# Altium schematic sheet Expansion _&_mikroBUS_Connectors.SchDoc: EXPANSION_&_mikroBUS_ Connectors
size A3; CompanyName: STMicroelectronics; Organization: Microcontrollers Division; Address1: 12, Rue Jules HOROWITZ; Address2: 38019 Grenoble; Address3: FRANCE; Revision: A-01; SheetNumber: 16; SheetTotal: 18; DocumentName: ARDUINO_ Connectors.SchDoc
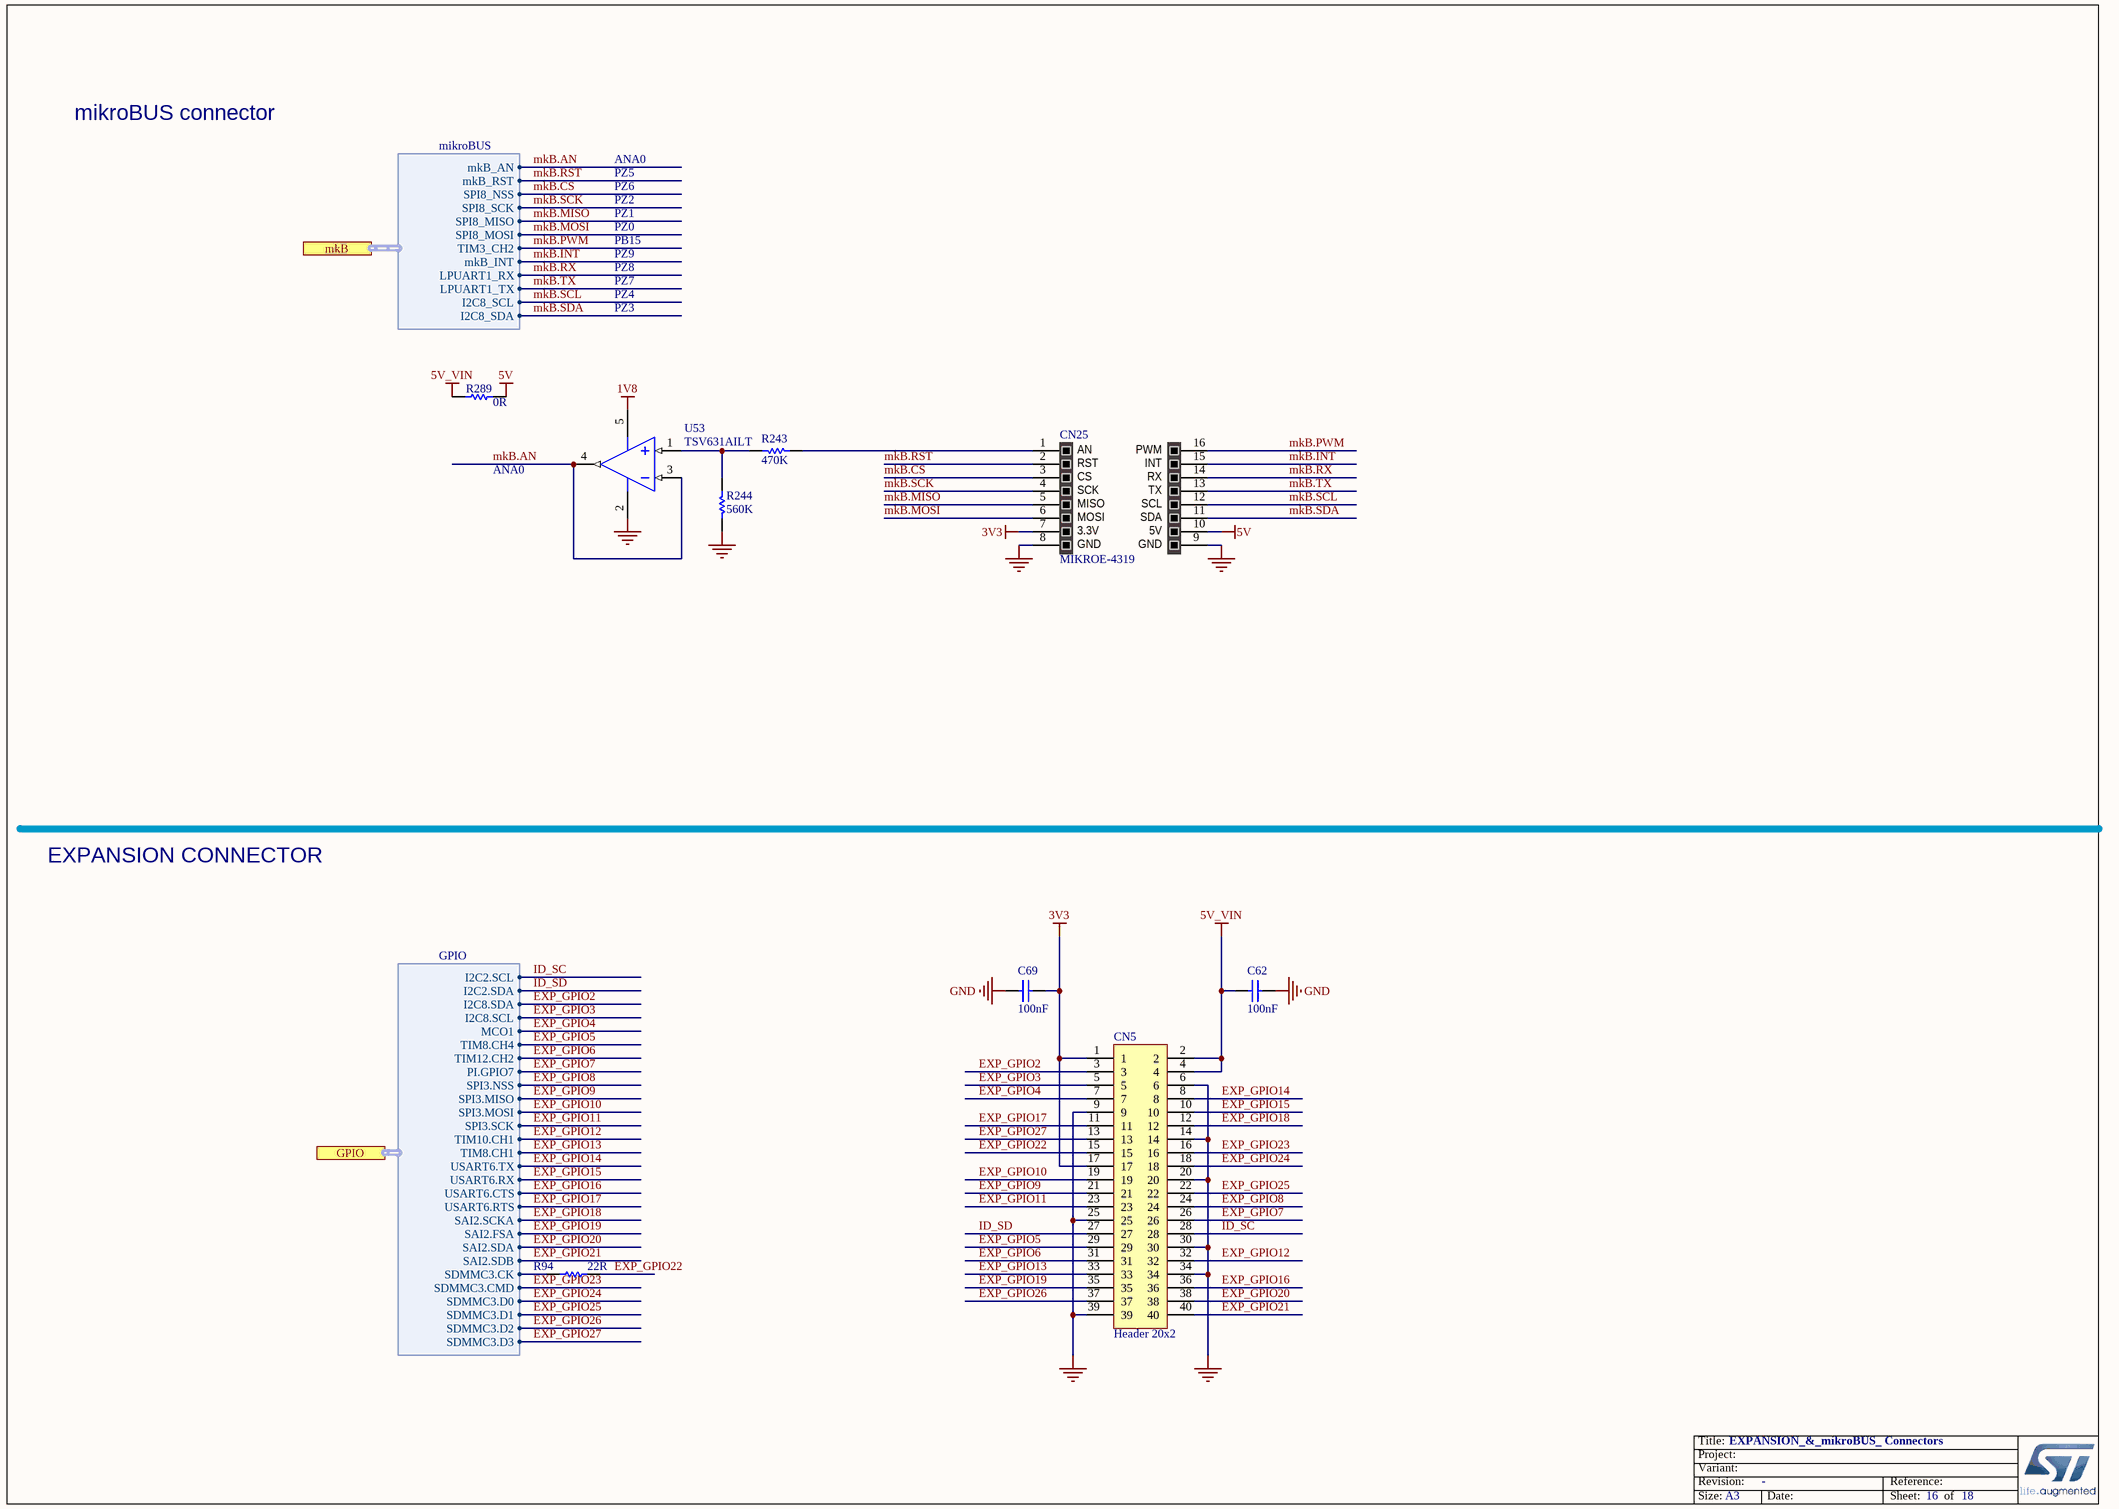
[diagram p0: Expansion _&_mikroBUS_Connectors.SchDoc]

## Parts
C62  value 100nF  [C0402]  (hidden comment: Capacitor)
C69  value 100nF  [C0402]  (hidden comment: Capacitor)
CN5  Header 20x2  [CON_SAMTEC_TSW-120-07-G-D]
CN25  MIKROE-4319  [SOCKET_MIKROBUS_MIKROE-4319_SMD_P254]
R94  value 22R  [R0201_H0P23]  (hidden comment: Resistor)
R243  value 470K  [R0402]  (hidden comment: Resistor)
R244  value 560K  [R0402]  (hidden comment: Resistor)
R289  value 0R  [R0402]
U53  TSV631AILT  [AOP_SOT23-5L_H1P45]

## Ports
GPIO (harness GPIO), mkB (harness mikroBUS)

## Harnesses
GPIO: I2C2.SCL, I2C2.SDA, I2C8.SDA, MCO1, TIM8.CH4, TIM12.CH2, PI.GPIO7, SPI3.NSS, SPI3.MISO, SPI3.MOSI, SPI3.SCK, TIM10.CH1, TIM8.CH1, USART6.TX, USART6.RX, USART6.CTS, USART6.RTS, SDMMC3.CK, SDMMC3.CMD, SDMMC3.D0, SDMMC3.D1, SDMMC3.D2, SDMMC3.D3, I2C8.SCL, SAI2.SCKA, SAI2.FSA, SAI2.SDA, SAI2.SDB
mikroBUS: I2C8_SDA, SPI8_NSS, SPI8_MISO, SPI8_MOSI, SPI8_SCK, TIM3_CH2, LPUART1_RX, I2C8_SCL, LPUART1_TX, mkB_INT, mkB_RST, mkB_AN

## Nets
1V8: U53.5(VCC)
3V3: C69.1 CN5.1 CN5.17 CN25.7
5V: CN25.10 R289.2
5V_VIN: C62.2 CN5.2 CN5.4 R289.1
GND: C62.1 C69.2 CN5.6 CN5.9 CN5.14 CN5.20 CN5.25 CN5.30 CN5.34 CN5.39 CN25.8 CN25.9 R244.1 U53.2(VDD)
EXP_GPIO2: CN5.3 ; port GPIO.I2C8.SDA
EXP_GPIO3: CN5.5 ; port GPIO.I2C8.SCL
EXP_GPIO4: CN5.7 ; port GPIO.MCO1
EXP_GPIO5: CN5.29 ; port GPIO.TIM8.CH4
EXP_GPIO6: CN5.31 ; port GPIO.TIM12.CH2
EXP_GPIO7: CN5.26 ; port GPIO.PI.GPIO7
EXP_GPIO8: CN5.24 ; port GPIO.SPI3.NSS
EXP_GPIO9: CN5.21 ; port GPIO.SPI3.MISO
EXP_GPIO10: CN5.19 ; port GPIO.SPI3.MOSI
EXP_GPIO11: CN5.23 ; port GPIO.SPI3.SCK
EXP_GPIO12: CN5.32 ; port GPIO.TIM10.CH1
EXP_GPIO13: CN5.33 ; port GPIO.TIM8.CH1
EXP_GPIO14: CN5.8 ; port GPIO.USART6.TX
EXP_GPIO15: CN5.10 ; port GPIO.USART6.RX
EXP_GPIO16: CN5.36 ; port GPIO.USART6.CTS
EXP_GPIO17: CN5.11 ; port GPIO.USART6.RTS
EXP_GPIO18: CN5.12 ; port GPIO.SAI2.SCKA
EXP_GPIO19: CN5.35 ; port GPIO.SAI2.FSA
EXP_GPIO20: CN5.38 ; port GPIO.SAI2.SDA
EXP_GPIO21: CN5.40 ; port GPIO.SAI2.SDB
EXP_GPIO22: CN5.15 R94.2
EXP_GPIO23: CN5.16 ; port GPIO.SDMMC3.CMD
EXP_GPIO24: CN5.18 ; port GPIO.SDMMC3.D0
EXP_GPIO25: CN5.22 ; port GPIO.SDMMC3.D1
EXP_GPIO26: CN5.37 ; port GPIO.SDMMC3.D2
EXP_GPIO27: CN5.13 ; port GPIO.SDMMC3.D3
ID_SC: CN5.28 ; port GPIO.I2C2.SCL
ID_SD: CN5.27 ; port GPIO.I2C2.SDA
mkB.AN: U53.3(IN-) U53.4(OUT) ; port mkB.mkB_AN
mkB.CS: CN25.3 ; port mkB.SPI8_NSS
mkB.INT: CN25.15 ; port mkB.mkB_INT
mkB.MISO: CN25.5 ; port mkB.SPI8_MISO
mkB.MOSI: CN25.6 ; port mkB.SPI8_MOSI
mkB.PWM: CN25.16 ; port mkB.TIM3_CH2
mkB.RST: CN25.2 ; port mkB.mkB_RST
mkB.RX: CN25.14 ; port mkB.LPUART1_RX
mkB.SCK: CN25.4 ; port mkB.SPI8_SCK
mkB.SCL: CN25.12 ; port mkB.I2C8_SCL
mkB.SDA: CN25.11 ; port mkB.I2C8_SDA
mkB.TX: CN25.13 ; port mkB.LPUART1_TX
NetCN25_1: CN25.1 R243.1
NetR94_1: R94.1 ; port GPIO.SDMMC3.CK
NetR243_2: R243.2 R244.2 U53.1(IN+)

## Notes on the sheet
- mikroBUS connector
- ANA0
- PZ5
- PZ6
- PZ2
- PZ1
- PZ0
- PB15
- PZ9
- PZ8
- PZ7
- PZ4
- PZ3
- EXPANSION CONNECTOR
- Title:
- Project:
- Size:
- Revision:
- Variant:
- A3
- -
- Date:
- Reference:
- Sheet:
- of
- (in symbol MCD-03517) AN; PWM; RST; INT; CS; RX; SCK; TX; MISO; SCL; MOSI; SDA; 3.3V; 5V; GND

## Library data of the parts
C62 C69 = MCD-00006: Capacitor, MLCC, 100nF, 16V, X7R, +/-10%, 0402, T=0.5mm; Part_Preference: Recommended; Manufacturer: YAGEO; Manufacturer_Part_Number: CC0402KRX7R7BB104; Order_Code_RS: 616-9701; Component_Country_Of_Origin: China; ShowFields: YES; ID: 2474; Internal_Part_Number: MCD-00006; Status: Released; Part_Type: Capacitor; Package: 0402; ComponentLink1URL: http://tunmcdsvn.tun.st.com/Component_Documentation_Library/Trunk/Capacitor/YAGEO_X7R_Series; Order_Code_Digikey: 311-1338-1-ND; Order_Code_Farnell: 9402047
CN5 = MCD-00302: Header, 20x2, 2.54mm, VR, TH, T=5.84mm/2.54mm; Manufacturer_Part_Number: TSW-120-07-G-D; Manufacturer: SAMTEC; Part_Type: Connector; Part_Preference: Recommended; Order_Code_RS: 180-2456; Component_Country_Of_Origin: China, Costa Rica, Malaysia, United States, Vietnam; ShowFields: YES; ID: 2567; Internal_Part_Number: MCD-00302; Value: Header 20x2; ComponentLink1URL: http://tunmcdsvn.tun.st.com/Component_Documentation_Library/Trunk/Connector/SAMTEC_TSW_Series/; Status: Released; Order_Code_Digikey: SAM1028-20-ND; Order_Code_Farnell: 2779689
CN25 = MCD-03517: Socket , mikroBUS , 16 , SMD , Gray; Part_Type: Connector; Part_Preference: Recommended; Manufacturer: MIKROE; Component_Country_Of_Origin: Serbia; ShowFields: YES; ID: 5633; Internal_Part_Number: MCD-03517; Value: MIKROE-4319; Status: Checked; Manufacturer_Part_Number: MIKROE-4319; ComponentLink1URL: http://tunmcdsvn.tun.st.com/Component_Documentation_Library/Trunk/Connector/MIKROE_4319; Order_Code_Digikey: 1471-MIKROE-4319-ND; Order_Code_Farnell: N/A; Order_Code_RS: N/A
R94 = MCD-02978: Resistor, 22R, 0201, +/-1%, 1/20W; Manufacturer_Part_Number: RC0201FR-0722RL; Manufacturer: YAGEO; Part_Preference: Recommended; Order_Code_RS: 198-7593; ID: 5094; ShowFields: YES; Internal_Part_Number: MCD-02978; Status: New; Part_Type: Resistor; ComponentLink1URL: http://tunmcdsvn.tun.st.com/Component_Documentation_Library/Trunk/Resistor/YAGEO_RC_L_Series; Package: 0201; Order_Code_Digikey: YAG2518TR-ND; Order_Code_Farnell: 2693564
R243 = MCD-00483: Resistor, 470K, 0402, +/-1%, 1/16W; Part_Preference: Recommended; Manufacturer: YAGEO; Manufacturer_Part_Number: RC0402FR-07470KL; Component_Country_Of_Origin: China; ShowFields: YES; ID: 2797; Internal_Part_Number: MCD-00483; Status: Released; Part_Type: Resistor; Package: 0402; ComponentLink1URL: http://tunmcdsvn.tun.st.com/Component_Documentation_Library/Trunk/Resistor/YAGEO_RC_L_Series; Order_Code_Digikey: 311-470KLRCT-ND; Order_Code_Farnell: 9239553; Order_Code_RS: N/A
R244 = MCD-00495: Resistor, 560K, 0402, +/-1%, 1/16W; Part_Preference: Recommended; Manufacturer: YAGEO; Manufacturer_Part_Number: RC0402FR-07560KL; Component_Country_Of_Origin: China; ShowFields: YES; ID: 2779; Internal_Part_Number: MCD-00495; Status: Released; Part_Type: Resistor; Package: 0402; ComponentLink1URL: http://tunmcdsvn.tun.st.com/Component_Documentation_Library/Trunk/Resistor/YAGEO_RC_L_Series; Order_Code_Digikey: 311-560KLRCT-ND; Order_Code_Farnell: 1458810; Order_Code_RS: N/A
R289 = MCD-00052: Resistor,0R,0402,5%,1/16W; Manufacturer_Part_Number: RC0402JR-070RL; Manufacturer: YAGEO; Part_Preference: Recommended; Provided_By: SUBCO; Initial_Board_Reference: mb1274; Order_Code_RS: 618-5804; Component_Country_Of_Origin: China; ID: 2540; ShowFields: YES; Internal_Part_Number: MCD-00052; ComponentLink1Description: Datasheet; ECCN_US: n/a; ECCN_EU: n/a; Status: Released; Part_Type: Resistor; ComponentLink1URL: http://tunmcdsvn.tun.st.com/Component_Documentation_Library/Trunk/Resistor/YAGEO_RC_L_Series; Package: 0402; Order_Code_Digikey: 311-0.0JRCT-ND; Order_Code_Farnell: 9232516RL
U53 = MCD-02043: Single,  rail to rail input/ouput 880Khz operational amplifiers; Part_Type: IC; Part_Preference: Recommended; Manufacturer: STMICROELECTRONICS; Manufacturer_HQ_COO: EU; Order_Code_RS: 189-2129; Component_Country_Of_Origin: Malaysia; ShowFields: YES; ID: 4143; Internal_Part_Number: MCD-02043; Value: TSV631AILT; Status: Checked; Manufacturer_Part_Number: TSV631AILT; Package: SOT23-5; ComponentLink1URL: http://tunmcdsvn.tun.st.com/Component_Documentation_Library/Trunk/IC/STMICROELECTRONICS_TSV631AILT; Order_Code_Digikey: 497-8542-1-ND; Order_Code_Farnell: 1737209